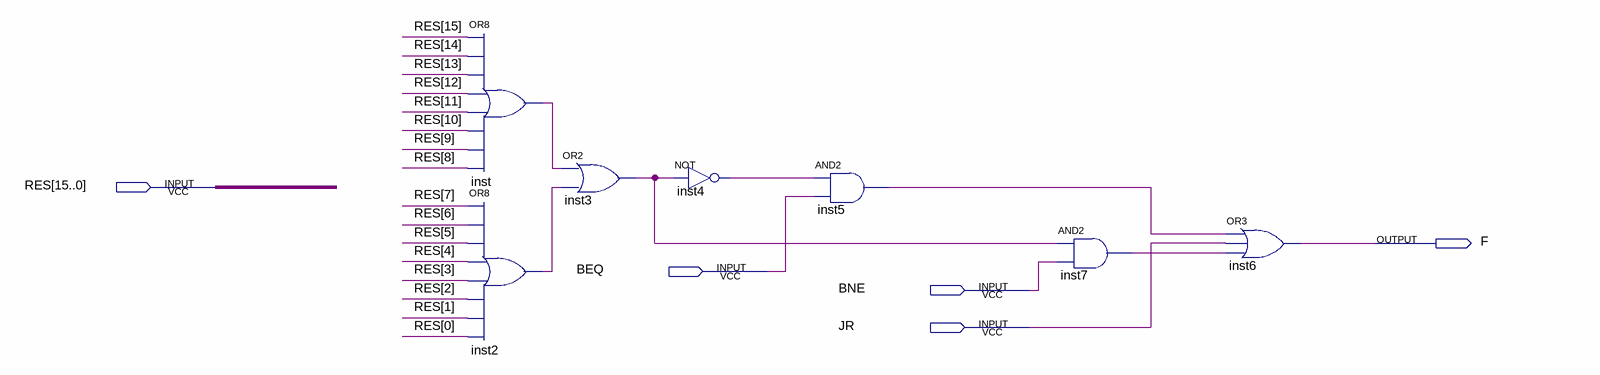
[diagram p0: schematic sheet]
// Quartus schematic Jump.bdf as structural Verilog: 7 symbols, 5 pins
module Jump (
  input  [15:0] RES,
  input  BEQ,
  input  BNE,
  input  JR,
  output F
);

  wire inst2_out, inst3_out, inst4_out, inst5_out, inst7_out, inst_out;

  or inst (inst_out, RES[15], RES[14], RES[13], RES[12], RES[11], RES[10], RES[9], RES[8]);
  or inst2 (inst2_out, RES[7], RES[6], RES[5], RES[4], RES[3], RES[2], RES[1], RES[0]);
  or inst3 (inst3_out, inst_out, inst2_out);
  not inst4 (inst4_out, inst3_out);
  and inst5 (inst5_out, inst4_out, BEQ);
  and inst7 (inst7_out, inst3_out, BNE);
  or inst6 (F, inst5_out, JR, inst7_out);
endmodule
